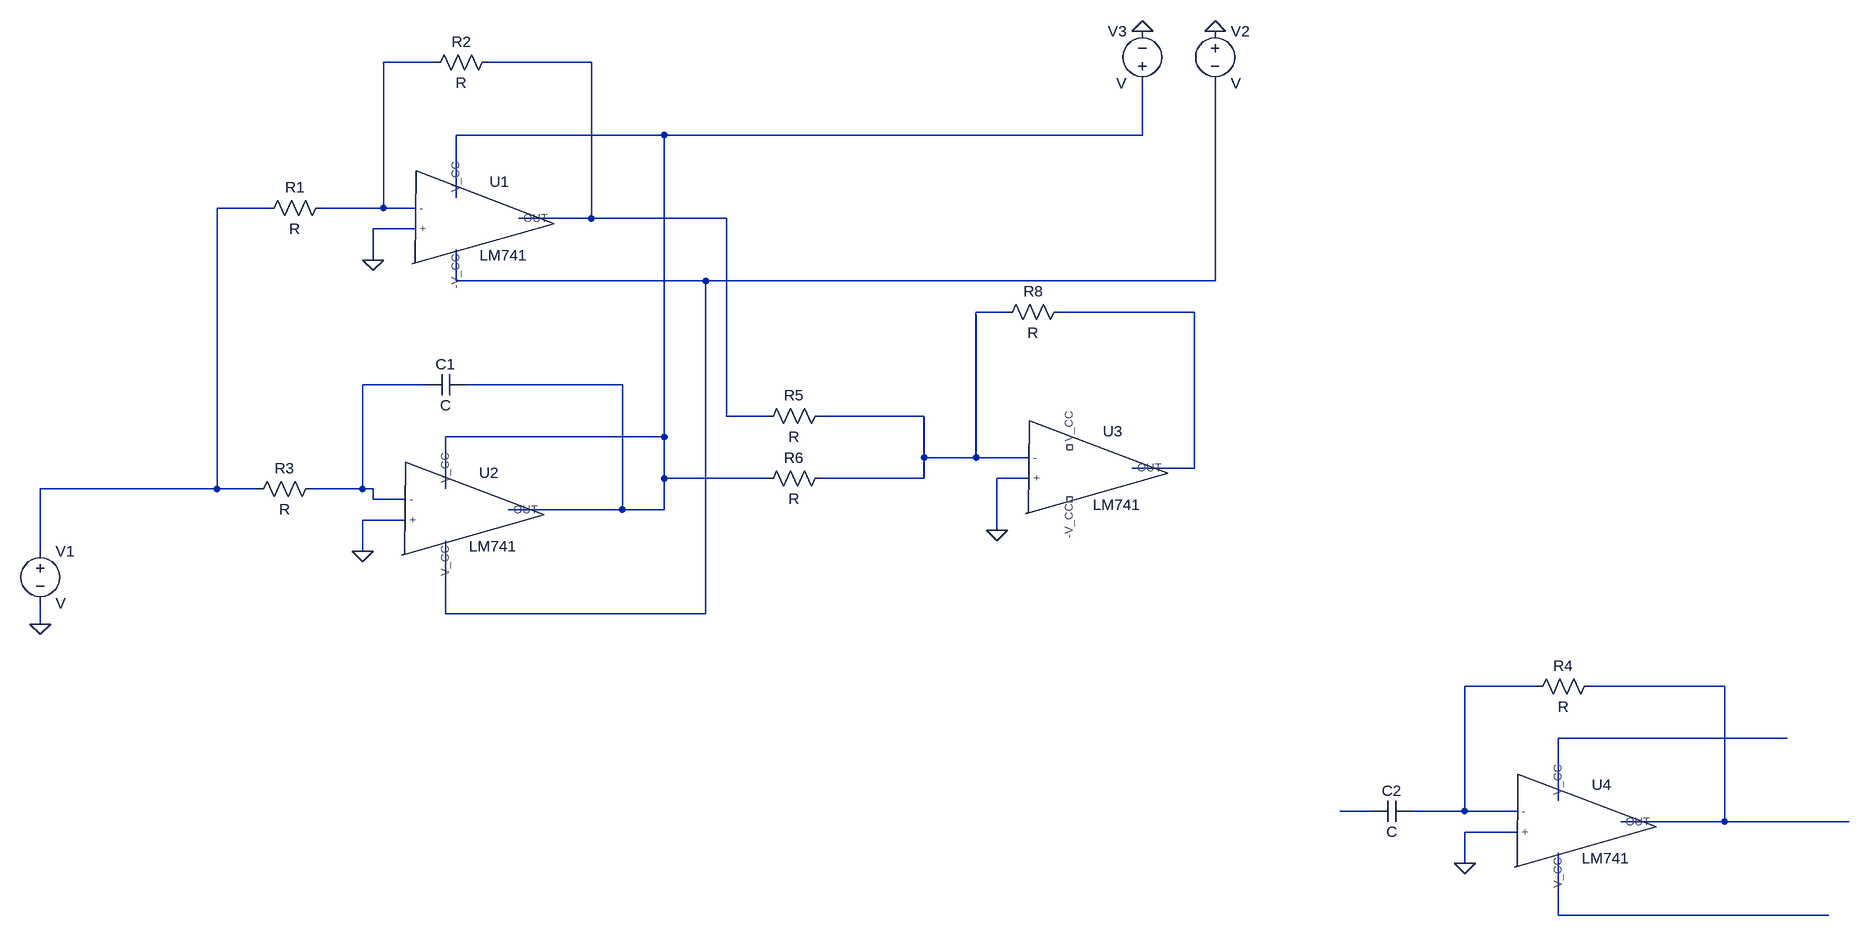
[diagram p0: schematic PID.asc]
PID.asc, the LTspice schematic file:
Version 4.1
SHEET 1 2212 1268
WIRE 32 -96 -48 -96
WIRE 272 -96 112 -96
WIRE 384 16 64 16
WIRE 1120 16 1120 -64
WIRE 1120 16 384 16
WIRE 64 112 64 16
WIRE -224 128 -304 128
WIRE -48 128 -48 -96
WIRE -48 128 -144 128
WIRE 0 128 -48 128
WIRE 272 144 272 -96
WIRE 272 144 160 144
WIRE 480 144 272 144
WIRE 0 160 -64 160
WIRE -64 208 -64 160
WIRE 64 240 64 192
WIRE 448 240 64 240
WIRE 1232 240 1232 -64
WIRE 1232 240 448 240
WIRE 912 288 864 288
WIRE 1200 288 992 288
WIRE 16 400 -80 400
WIRE 320 400 80 400
WIRE 480 448 480 144
WIRE 544 448 480 448
WIRE 784 448 624 448
WIRE 384 480 384 16
WIRE 384 480 48 480
WIRE 784 512 784 448
WIRE 864 512 864 288
WIRE 864 512 784 512
WIRE 944 512 864 512
WIRE 1200 528 1200 288
WIRE 1200 528 1104 528
WIRE 384 544 384 480
WIRE 544 544 384 544
WIRE 784 544 784 512
WIRE 784 544 624 544
WIRE 944 544 896 544
WIRE -304 560 -304 128
WIRE -304 560 -576 560
WIRE -240 560 -304 560
WIRE -80 560 -80 400
WIRE -80 560 -160 560
WIRE -64 560 -80 560
WIRE 48 560 48 480
WIRE -64 576 -64 560
WIRE -16 576 -64 576
WIRE 320 592 320 400
WIRE 320 592 144 592
WIRE 384 592 384 544
WIRE 384 592 320 592
WIRE -16 608 -80 608
WIRE 896 624 896 544
WIRE -576 656 -576 560
WIRE -80 656 -80 608
WIRE 48 752 48 640
WIRE 448 752 448 240
WIRE 448 752 48 752
WIRE -576 768 -576 736
WIRE 1728 864 1616 864
WIRE 2016 864 1808 864
WIRE 2112 944 1760 944
WIRE 1760 1040 1760 944
WIRE 1472 1056 1424 1056
WIRE 1616 1056 1616 864
WIRE 1616 1056 1536 1056
WIRE 1696 1056 1616 1056
WIRE 2016 1072 2016 864
WIRE 2016 1072 1856 1072
WIRE 2208 1072 2016 1072
WIRE 1696 1088 1616 1088
WIRE 1616 1136 1616 1088
WIRE 1760 1216 1760 1120
WIRE 2176 1216 1760 1216
FLAG -576 768 0
FLAG -80 656 0
FLAG 1616 1136 0
FLAG -64 208 0
FLAG 896 624 0
FLAG 1232 -144 0
FLAG 1120 -144 0
SYMBOL LM741 64 144 R0
SYMATTR InstName U1
SYMBOL LM741 48 592 R0
SYMATTR InstName U2
SYMBOL LM741 1008 528 R0
SYMATTR InstName U3
SYMBOL LM741 1760 1072 R0
SYMATTR InstName U4
SYMBOL res -128 112 R90
WINDOW 0 0 56 VBottom 2
WINDOW 3 32 56 VTop 2
SYMATTR InstName R1
SYMBOL res 128 -112 R90
WINDOW 0 0 56 VBottom 2
WINDOW 3 32 56 VTop 2
SYMATTR InstName R2
SYMBOL res -144 544 R90
WINDOW 0 0 56 VBottom 2
WINDOW 3 32 56 VTop 2
SYMATTR InstName R3
SYMBOL cap 80 384 R90
WINDOW 0 0 32 VBottom 2
WINDOW 3 32 32 VTop 2
SYMATTR InstName C1
SYMBOL cap 1536 1040 R90
WINDOW 0 0 32 VBottom 2
WINDOW 3 32 32 VTop 2
SYMATTR InstName C2
SYMBOL res 1824 848 R90
WINDOW 0 0 56 VBottom 2
WINDOW 3 32 56 VTop 2
SYMATTR InstName R4
SYMBOL res 640 432 R90
WINDOW 0 0 56 VBottom 2
WINDOW 3 32 56 VTop 2
SYMATTR InstName R5
SYMBOL res 640 528 R90
WINDOW 0 0 56 VBottom 2
WINDOW 3 32 56 VTop 2
SYMATTR InstName R6
SYMBOL voltage -576 640 R0
SYMATTR InstName V1
SYMBOL res 1008 272 R90
WINDOW 0 0 56 VBottom 2
WINDOW 3 32 56 VTop 2
SYMATTR InstName R8
SYMBOL voltage 1232 -160 R0
SYMATTR InstName V2
SYMBOL voltage 1120 -48 R180
WINDOW 0 24 96 Left 2
WINDOW 3 24 16 Left 2
SYMATTR InstName V3

The netlist it stands for:
* PID.asc
X§U1 0 N001 N003 N005 N002 LM741  ; pins + - V_CC -V_CC OUT
X§U2 0 N008 N003 N005 N003 LM741  ; pins + - V_CC -V_CC OUT
X§U3 0 N006 NC_01 NC_02 N007 LM741  ; pins + - V_CC -V_CC OUT
X§U4 0 N009 N011 N013 N010 LM741  ; pins + - V_CC -V_CC OUT
R1 N001 N004 R
R2 N002 N001 R
R3 N008 N004 R
C1 N003 N008 C
C2 N009 N012 C
R4 N010 N009 R
R5 N006 N002 R
R6 N006 N003 R
V1 N004 0 V
R8 N007 N006 R
V2 0 N005 V
V3 N003 0 V
.lib F:\DOWNLOADS\snom211b\lm741.lib
.backanno
.end